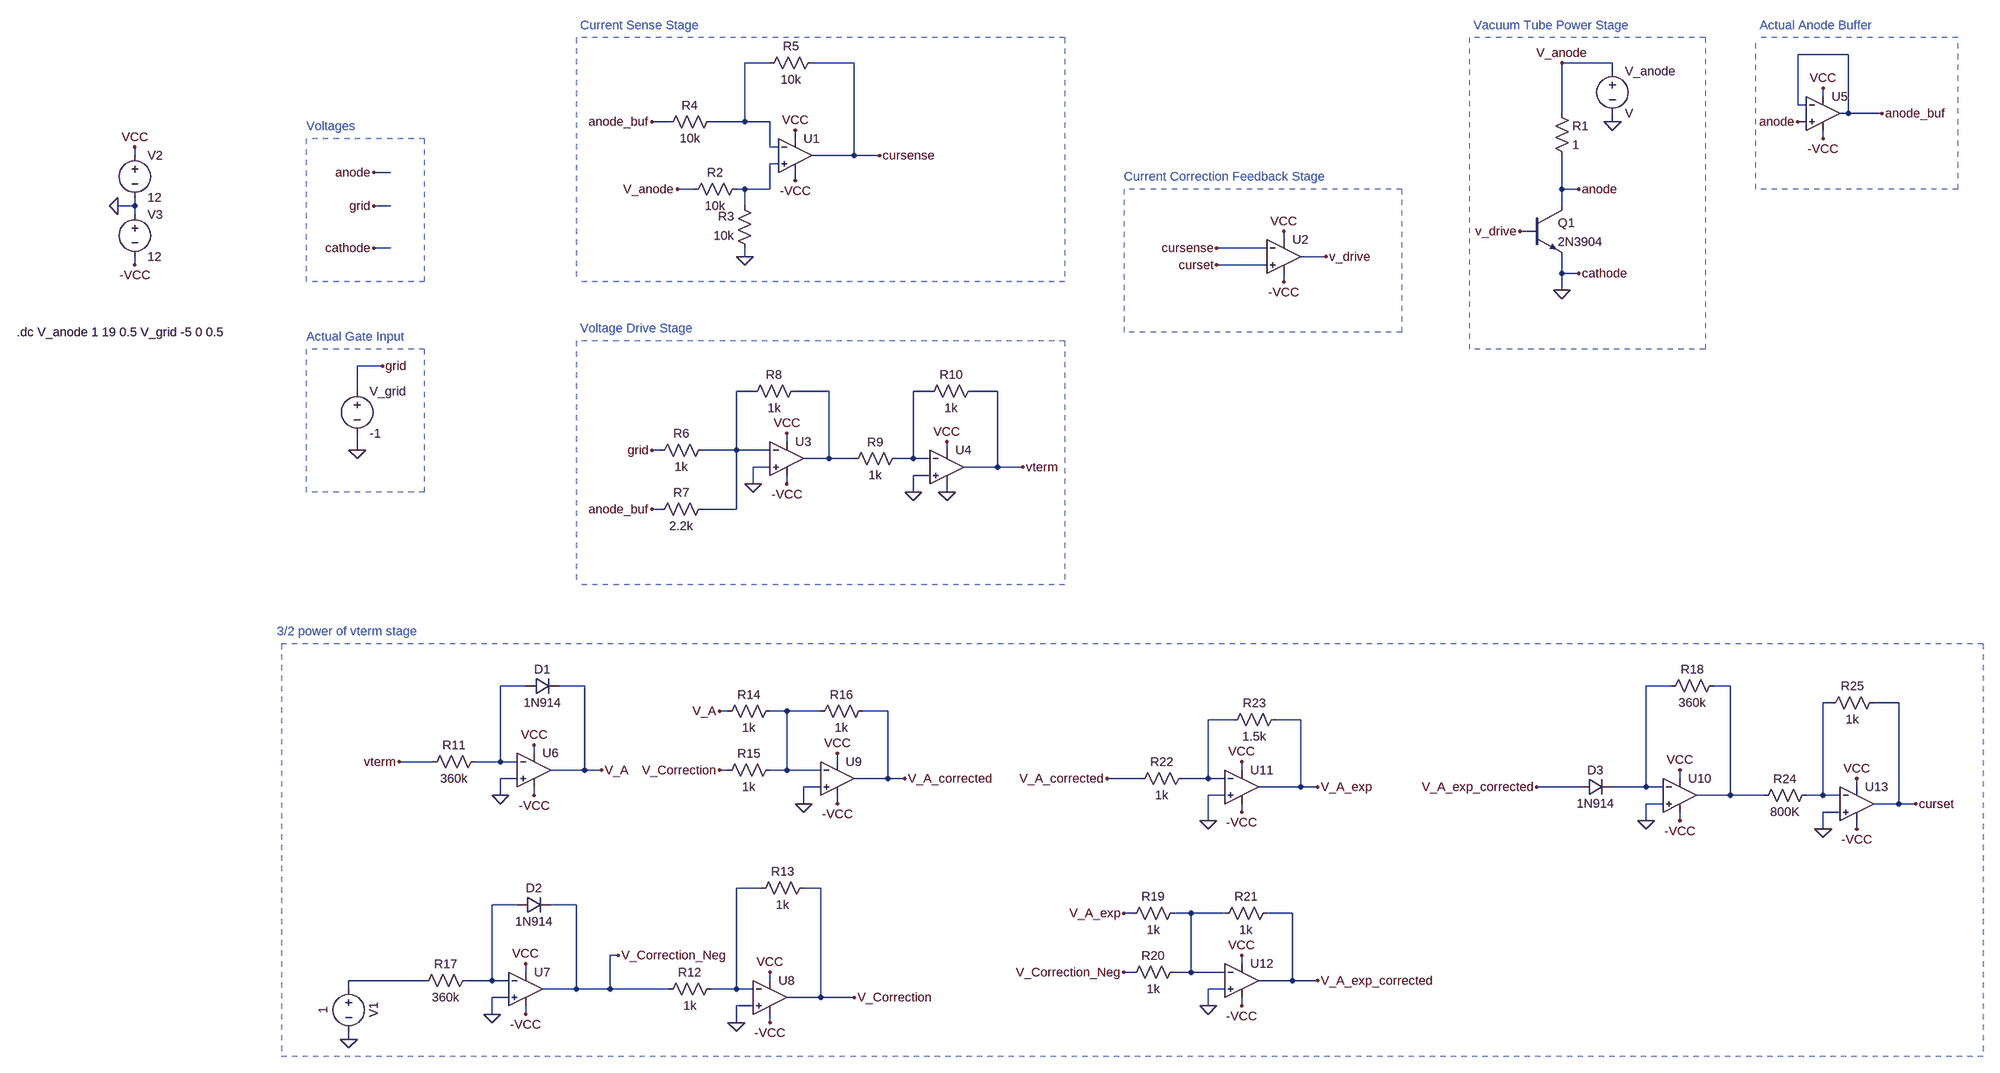
[diagram p0: schematic tube_second_iteration.asc]
tube_second_iteration.asc, the LTspice schematic file:
Version 4
SHEET 1 4020 1812
WIRE 3184 -400 3088 -400
WIRE 1136 -384 1088 -384
WIRE 1296 -384 1216 -384
WIRE 2736 -384 2640 -384
WIRE 2736 -368 2736 -384
WIRE 3136 -320 3136 -336
WIRE 3088 -304 3088 -400
WIRE 3104 -304 3088 -304
WIRE 2640 -288 2640 -384
WIRE 3184 -288 3184 -400
WIRE 3184 -288 3168 -288
WIRE 3248 -288 3184 -288
WIRE 944 -272 912 -272
WIRE 1088 -272 1088 -384
WIRE 1088 -272 1024 -272
WIRE 1136 -272 1088 -272
WIRE 2736 -272 2736 -288
WIRE 3104 -272 3088 -272
WIRE 1184 -240 1184 -256
WIRE 3136 -240 3136 -256
WIRE 1136 -224 1136 -272
WIRE 1152 -224 1136 -224
WIRE -352 -208 -352 -224
WIRE 1296 -208 1296 -384
WIRE 1296 -208 1216 -208
WIRE 1344 -208 1296 -208
WIRE 1152 -192 1136 -192
WIRE 416 -176 384 -176
WIRE 1184 -160 1184 -176
WIRE 992 -144 960 -144
WIRE 1088 -144 1072 -144
WIRE 1136 -144 1136 -192
WIRE 1136 -144 1088 -144
WIRE 2640 -144 2640 -208
WIRE 2672 -144 2640 -144
WIRE -352 -112 -352 -128
WIRE -352 -112 -384 -112
WIRE 416 -112 384 -112
WIRE 1088 -112 1088 -144
WIRE 2640 -112 2640 -144
WIRE -352 -96 -352 -112
WIRE 2576 -64 2560 -64
WIRE 2112 -48 2112 -64
WIRE 416 -32 384 -32
WIRE 2080 -32 1984 -32
WIRE 1088 -16 1088 -32
WIRE 2192 -16 2144 -16
WIRE -352 0 -352 -16
WIRE 2080 0 1984 0
WIRE 2640 16 2640 -16
WIRE 2672 16 2640 16
WIRE 2112 32 2112 16
WIRE 2640 48 2640 16
WIRE 400 192 352 192
WIRE 352 240 352 192
WIRE 1104 240 1072 240
WIRE 1248 240 1184 240
WIRE 1440 240 1408 240
WIRE 1568 240 1520 240
WIRE 1168 336 1168 320
WIRE 352 352 352 320
WIRE 928 352 912 352
WIRE 1072 352 1072 240
WIRE 1072 352 1008 352
WIRE 1136 352 1072 352
WIRE 1472 352 1472 336
WIRE 1248 368 1248 240
WIRE 1248 368 1200 368
WIRE 1296 368 1248 368
WIRE 1408 368 1408 240
WIRE 1408 368 1376 368
WIRE 1440 368 1408 368
WIRE 1136 384 1104 384
WIRE 1568 384 1568 240
WIRE 1568 384 1504 384
WIRE 1616 384 1568 384
WIRE 1440 400 1408 400
WIRE 1104 416 1104 384
WIRE 1168 416 1168 400
WIRE 1408 432 1408 400
WIRE 1472 432 1472 416
WIRE 928 464 912 464
WIRE 1072 464 1072 352
WIRE 1072 464 1008 464
WIRE 672 800 624 800
WIRE 784 800 736 800
WIRE 2848 800 2800 800
WIRE 2960 800 2928 800
WIRE 3152 832 3136 832
WIRE 3280 832 3232 832
WIRE 1056 848 1040 848
WIRE 1168 848 1136 848
WIRE 1232 848 1168 848
WIRE 1360 848 1312 848
WIRE 2016 864 1968 864
WIRE 2144 864 2096 864
WIRE 688 928 688 912
WIRE 496 944 432 944
WIRE 624 944 624 800
WIRE 624 944 576 944
WIRE 656 944 624 944
WIRE 1264 944 1264 928
WIRE 784 960 784 800
WIRE 784 960 720 960
WIRE 816 960 784 960
WIRE 1056 960 1040 960
WIRE 1168 960 1168 848
WIRE 1168 960 1136 960
WIRE 1232 960 1168 960
WIRE 2032 960 2032 944
WIRE 656 976 624 976
WIRE 1360 976 1360 848
WIRE 1360 976 1296 976
WIRE 1392 976 1360 976
WIRE 1840 976 1776 976
WIRE 1968 976 1968 864
WIRE 1968 976 1920 976
WIRE 2000 976 1968 976
WIRE 2864 976 2864 960
WIRE 1232 992 1200 992
WIRE 2144 992 2144 864
WIRE 2144 992 2064 992
WIRE 2176 992 2144 992
WIRE 2672 992 2592 992
WIRE 2800 992 2800 800
WIRE 2800 992 2736 992
WIRE 2832 992 2800 992
WIRE 3200 992 3200 976
WIRE 624 1008 624 976
WIRE 688 1008 688 992
WIRE 2000 1008 1968 1008
WIRE 2960 1008 2960 800
WIRE 2960 1008 2896 1008
WIRE 3024 1008 2960 1008
WIRE 3136 1008 3136 832
WIRE 3136 1008 3104 1008
WIRE 3168 1008 3136 1008
WIRE 1200 1024 1200 992
WIRE 1264 1024 1264 1008
WIRE 2832 1024 2800 1024
WIRE 3280 1024 3280 832
WIRE 3280 1024 3232 1024
WIRE 3312 1024 3280 1024
WIRE 2032 1040 2032 1024
WIRE 3168 1040 3136 1040
WIRE 1968 1056 1968 1008
WIRE 2800 1056 2800 1024
WIRE 2864 1056 2864 1040
WIRE 3136 1072 3136 1040
WIRE 3200 1072 3200 1056
WIRE 1120 1184 1072 1184
WIRE 1232 1184 1200 1184
WIRE 656 1216 608 1216
WIRE 768 1216 720 1216
WIRE 1824 1232 1808 1232
WIRE 1936 1232 1904 1232
WIRE 2000 1232 1936 1232
WIRE 2128 1232 2080 1232
WIRE 848 1312 832 1312
WIRE 2032 1328 2032 1312
WIRE 672 1344 672 1328
WIRE 1824 1344 1808 1344
WIRE 1936 1344 1936 1232
WIRE 1936 1344 1904 1344
WIRE 2000 1344 1936 1344
WIRE 480 1360 336 1360
WIRE 608 1360 608 1216
WIRE 608 1360 560 1360
WIRE 640 1360 608 1360
WIRE 1136 1360 1136 1344
WIRE 2128 1360 2128 1232
WIRE 2128 1360 2064 1360
WIRE 2176 1360 2128 1360
WIRE 336 1376 336 1360
WIRE 768 1376 768 1216
WIRE 768 1376 704 1376
WIRE 832 1376 832 1312
WIRE 832 1376 768 1376
WIRE 944 1376 832 1376
WIRE 1072 1376 1072 1184
WIRE 1072 1376 1024 1376
WIRE 1104 1376 1072 1376
WIRE 2000 1376 1968 1376
WIRE 640 1392 608 1392
WIRE 1232 1392 1232 1184
WIRE 1232 1392 1168 1392
WIRE 1296 1392 1232 1392
WIRE 1104 1408 1072 1408
WIRE 1968 1408 1968 1376
WIRE 2032 1408 2032 1392
WIRE 608 1424 608 1392
WIRE 672 1424 672 1408
WIRE 1072 1440 1072 1408
WIRE 1136 1440 1136 1424
WIRE 336 1472 336 1456
FLAG -384 -112 0
FLAG -352 -224 VCC
FLAG -352 0 -VCC
FLAG 2640 48 0
FLAG 3248 -288 anode_buf
FLAG 1088 -16 0
FLAG 1184 -256 VCC
FLAG 1184 -160 -VCC
FLAG 912 -272 anode_buf
FLAG 1344 -208 cursense
FLAG 1984 -32 cursense
FLAG 2112 -64 VCC
FLAG 2112 32 -VCC
FLAG 400 192 grid
FLAG 352 352 0
FLAG 1104 416 0
FLAG 1168 320 VCC
FLAG 912 464 anode_buf
FLAG 912 352 grid
FLAG 1408 432 0
FLAG 1472 336 VCC
FLAG 1616 384 vterm
FLAG 1168 416 -VCC
FLAG 1472 432 0
FLAG 3136 -336 VCC
FLAG 3136 -240 -VCC
FLAG 2736 -272 0
FLAG 2640 -384 V_anode
FLAG 960 -144 V_anode
FLAG 2672 -144 anode
FLAG 3088 -272 anode
FLAG 2672 16 cathode
FLAG 2192 -16 v_drive
FLAG 2560 -64 v_drive
FLAG 384 -112 grid
FLAG 384 -176 anode
FLAG 384 -32 cathode
FLAG 608 1424 0
FLAG 336 1472 0
FLAG 624 1008 0
FLAG 1072 1440 0
FLAG 1296 1392 V_Correction
FLAG 1040 848 V_A
FLAG 1040 960 V_Correction
FLAG 1200 1024 0
FLAG 1392 976 V_A_corrected
FLAG 2800 1056 0
FLAG 848 1312 V_Correction_Neg
FLAG 1776 976 V_A_corrected
FLAG 1968 1408 0
FLAG 1808 1232 V_A_exp
FLAG 2176 992 V_A_exp
FLAG 2176 1360 V_A_exp_corrected
FLAG 1808 1344 V_Correction_Neg
FLAG 2592 992 V_A_exp_corrected
FLAG 1968 1056 0
FLAG 816 960 V_A
FLAG 688 912 VCC
FLAG 688 1008 -VCC
FLAG 1264 928 VCC
FLAG 1264 1024 -VCC
FLAG 672 1328 VCC
FLAG 672 1424 -VCC
FLAG 1136 1344 VCC
FLAG 1136 1440 -VCC
FLAG 2032 944 VCC
FLAG 2032 1040 -VCC
FLAG 2032 1312 VCC
FLAG 2032 1408 -VCC
FLAG 2864 960 VCC
FLAG 2864 1056 -VCC
FLAG 432 944 vterm
FLAG 3200 976 VCC
FLAG 3200 1072 -VCC
FLAG 3136 1072 0
FLAG 3312 1024 curset
FLAG 1984 0 curset
SYMBOL npn 2576 -112 R0
SYMATTR InstName Q1
SYMATTR Value 2N3904
SYMBOL voltage -352 -224 R0
WINDOW 123 0 0 Left 0
WINDOW 39 0 0 Left 0
SYMATTR InstName V2
SYMATTR Value 12
SYMBOL voltage -352 -112 R0
WINDOW 123 0 0 Left 0
WINDOW 39 0 0 Left 0
SYMATTR InstName V3
SYMATTR Value 12
SYMBOL OpAmps\\UniversalOpAmp2 1184 -208 R0
SYMATTR InstName U1
SYMBOL res 1088 -160 R90
WINDOW 0 0 56 VBottom 2
WINDOW 3 32 56 VTop 2
SYMATTR InstName R2
SYMATTR Value 10k
SYMBOL res 1104 -16 R180
WINDOW 0 36 76 Left 2
WINDOW 3 36 40 Left 2
SYMATTR InstName R3
SYMATTR Value 10k
SYMBOL res 1040 -288 R90
WINDOW 0 0 56 VBottom 2
WINDOW 3 32 56 VTop 2
SYMATTR InstName R4
SYMATTR Value 10k
SYMBOL res 1232 -400 R90
WINDOW 0 0 56 VBottom 2
WINDOW 3 32 56 VTop 2
SYMATTR InstName R5
SYMATTR Value 10k
SYMBOL OpAmps\\UniversalOpAmp2 2112 -16 R0
SYMATTR InstName U2
SYMBOL voltage 352 224 R0
WINDOW 123 0 0 Left 0
WINDOW 39 0 0 Left 0
SYMATTR InstName V_grid
SYMATTR Value -1
SYMBOL OpAmps\\UniversalOpAmp2 1168 368 R0
SYMATTR InstName U3
SYMBOL res 1024 336 R90
WINDOW 0 0 56 VBottom 2
WINDOW 3 32 56 VTop 2
SYMATTR InstName R6
SYMATTR Value 1k
SYMBOL res 1024 448 R90
WINDOW 0 0 56 VBottom 2
WINDOW 3 32 56 VTop 2
SYMATTR InstName R7
SYMATTR Value 2.2k
SYMBOL res 1200 224 R90
WINDOW 0 0 56 VBottom 2
WINDOW 3 32 56 VTop 2
SYMATTR InstName R8
SYMATTR Value 1k
SYMBOL res 1392 352 R90
WINDOW 0 0 56 VBottom 2
WINDOW 3 32 56 VTop 2
SYMATTR InstName R9
SYMATTR Value 1k
SYMBOL OpAmps\\UniversalOpAmp2 1472 384 R0
SYMATTR InstName U4
SYMBOL res 1536 224 R90
WINDOW 0 0 56 VBottom 2
WINDOW 3 32 56 VTop 2
SYMATTR InstName R10
SYMATTR Value 1k
SYMBOL OpAmps\\UniversalOpAmp2 3136 -288 R0
SYMATTR InstName U5
SYMBOL voltage 2736 -384 R0
SYMATTR InstName V_anode
SYMBOL res 2624 -304 R0
SYMATTR InstName R1
SYMATTR Value 1
SYMBOL voltage 336 1360 R0
WINDOW 0 32 56 VTop 2
WINDOW 3 -32 56 VBottom 2
WINDOW 123 0 0 Left 0
WINDOW 39 0 0 Left 0
SYMATTR InstName V1
SYMATTR Value 1
SYMBOL res 592 928 R90
WINDOW 0 0 56 VBottom 2
WINDOW 3 32 56 VTop 2
SYMATTR InstName R11
SYMATTR Value 360k
SYMBOL res 1040 1360 R90
WINDOW 0 0 56 VBottom 2
WINDOW 3 32 56 VTop 2
SYMATTR InstName R12
SYMATTR Value 1k
SYMBOL res 1216 1168 R90
WINDOW 0 0 56 VBottom 2
WINDOW 3 32 56 VTop 2
SYMATTR InstName R13
SYMATTR Value 1k
SYMBOL res 1152 832 R90
WINDOW 0 0 56 VBottom 2
WINDOW 3 32 56 VTop 2
SYMATTR InstName R14
SYMATTR Value 1k
SYMBOL res 1152 944 R90
WINDOW 0 0 56 VBottom 2
WINDOW 3 32 56 VTop 2
SYMATTR InstName R15
SYMATTR Value 1k
SYMBOL res 1328 832 R90
WINDOW 0 0 56 VBottom 2
WINDOW 3 32 56 VTop 2
SYMATTR InstName R16
SYMATTR Value 1k
SYMBOL diode 672 816 R270
WINDOW 0 32 32 VTop 2
WINDOW 3 0 32 VBottom 2
SYMATTR InstName D1
SYMATTR Value 1N914
SYMBOL diode 656 1232 R270
WINDOW 0 32 32 VTop 2
WINDOW 3 0 32 VBottom 2
SYMATTR InstName D2
SYMATTR Value 1N914
SYMBOL diode 2672 1008 R270
WINDOW 0 32 32 VTop 2
WINDOW 3 0 32 VBottom 2
SYMATTR InstName D3
SYMATTR Value 1N914
SYMBOL res 576 1344 R90
WINDOW 0 0 56 VBottom 2
WINDOW 3 32 56 VTop 2
SYMATTR InstName R17
SYMATTR Value 360k
SYMBOL res 2944 784 R90
WINDOW 0 0 56 VBottom 2
WINDOW 3 32 56 VTop 2
SYMATTR InstName R18
SYMATTR Value 360k
SYMBOL res 1920 1216 R90
WINDOW 0 0 56 VBottom 2
WINDOW 3 32 56 VTop 2
SYMATTR InstName R19
SYMATTR Value 1k
SYMBOL res 1920 1328 R90
WINDOW 0 0 56 VBottom 2
WINDOW 3 32 56 VTop 2
SYMATTR InstName R20
SYMATTR Value 1k
SYMBOL res 2096 1216 R90
WINDOW 0 0 56 VBottom 2
WINDOW 3 32 56 VTop 2
SYMATTR InstName R21
SYMATTR Value 1k
SYMBOL res 1824 992 R270
WINDOW 0 32 56 VTop 2
WINDOW 3 0 56 VBottom 2
SYMATTR InstName R22
SYMATTR Value 1k
SYMBOL res 2112 848 R90
WINDOW 0 0 56 VBottom 2
WINDOW 3 32 56 VTop 2
SYMATTR InstName R23
SYMATTR Value 1.5k
SYMBOL OpAmps\\UniversalOpAmp2 688 960 R0
SYMATTR InstName U6
SYMBOL OpAmps\\UniversalOpAmp2 1264 976 R0
SYMATTR InstName U9
SYMBOL OpAmps\\UniversalOpAmp2 672 1376 R0
SYMATTR InstName U7
SYMBOL OpAmps\\UniversalOpAmp2 1136 1392 R0
SYMATTR InstName U8
SYMBOL OpAmps\\UniversalOpAmp2 2032 992 R0
SYMATTR InstName U11
SYMBOL OpAmps\\UniversalOpAmp2 2032 1360 R0
SYMATTR InstName U12
SYMBOL OpAmps\\UniversalOpAmp2 2864 1008 R0
SYMATTR InstName U10
SYMBOL OpAmps\\UniversalOpAmp2 3200 1024 R0
SYMATTR InstName U13
SYMBOL res 3120 992 R90
WINDOW 0 0 56 VBottom 2
WINDOW 3 32 56 VTop 2
SYMATTR InstName R24
SYMATTR Value 800K
SYMBOL res 3248 816 R90
WINDOW 0 0 56 VBottom 2
WINDOW 3 32 56 VTop 2
SYMATTR InstName R25
SYMATTR Value 1k
TEXT -576 128 Left 2 !.dc V_anode 1 19 0.5 V_grid -5 0 0.5
TEXT 2472 -456 Left 2 ;Vacuum Tube Power Stage
TEXT 3016 -456 Left 2 ;Actual Anode Buffer
TEXT 256 136 Left 2 ;Actual Gate Input
TEXT 776 -456 Left 2 ;Current Sense Stage
TEXT 776 120 Left 2 ;Voltage Drive Stage
TEXT 1808 -168 Left 2 ;Current Correction Feedback Stage
TEXT 256 -264 Left 2 ;Voltages
TEXT 200 696 Left 2 ;3/2 power of vterm stage
LINE Normal 2912 -432 2464 -432 2
LINE Normal 2464 -432 2464 160 2
LINE Normal 2912 160 2464 160 2
LINE Normal 2912 -432 2912 160 2
LINE Normal 3392 -432 3008 -432 2
LINE Normal 3392 -144 3008 -144 2
LINE Normal 3392 -144 3392 -432 2
LINE Normal 3008 -144 3008 -432 2
LINE Normal 480 160 256 160 2
LINE Normal 480 432 256 432 2
LINE Normal 480 432 480 160 2
LINE Normal 256 432 256 160 2
LINE Normal 768 -432 768 32 2
LINE Normal 1696 -432 1696 32 2
LINE Normal 1696 -432 768 -432 2
LINE Normal 1696 32 768 32 2
LINE Normal 1808 -144 1808 128 2
LINE Normal 2336 -144 2336 128 2
LINE Normal 2336 -144 1808 -144 2
LINE Normal 2336 128 1808 128 2
LINE Normal 768 144 768 608 2
LINE Normal 1696 144 1696 608 2
LINE Normal 1696 144 768 144 2
LINE Normal 1696 608 768 608 2
LINE Normal 480 -240 256 -240 2
LINE Normal 480 32 256 32 2
LINE Normal 480 32 480 -240 2
LINE Normal 256 32 256 -240 2
LINE Normal 3440 720 208 720 2
LINE Normal 3440 1504 208 1504 2
LINE Normal 3440 720 3440 1504 2
LINE Normal 208 720 208 1504 2

The netlist it stands for:
* tube_second_iteration.asc
Q1 anode v_drive 0 0 2N3904
V2 VCC 0 12
V3 0 -VCC 12
XU1 N002 N001 VCC -VCC cursense level2 Avol=1Meg GBW=10Meg Slew=10Meg Ilimit=25m Rail=0 Vos=0 En=0 Enk=0 In=0 Ink=0 Rin=500Meg  ; pins In+ In- V+ V- OUT
R2 N002 V_anode 10k
R3 0 N002 10k
R4 N001 anode_buf 10k
R5 cursense N001 10k
XU2 curset cursense VCC -VCC v_drive level2 Avol=1Meg GBW=10Meg Slew=10Meg Ilimit=25m Rail=0 Vos=0 En=0 Enk=0 In=0 Ink=0 Rin=500Meg  ; pins In+ In- V+ V- OUT
V_grid grid 0 -1
XU3 0 N003 VCC -VCC N004 level2 Avol=1Meg GBW=10Meg Slew=10Meg Ilimit=25m Rail=0 Vos=0 En=0 Enk=0 In=0 Ink=0 Rin=500Meg  ; pins In+ In- V+ V- OUT
R6 N003 grid 1k
R7 N003 anode_buf 2.2k
R8 N004 N003 1k
R9 N005 N004 1k
XU4 0 N005 VCC 0 vterm level2 Avol=1Meg GBW=10Meg Slew=10Meg Ilimit=25m Rail=0 Vos=0 En=0 Enk=0 In=0 Ink=0 Rin=500Meg  ; pins In+ In- V+ V- OUT
R10 vterm N005 1k
XU5 anode anode_buf VCC -VCC anode_buf level2 Avol=1Meg GBW=10Meg Slew=10Meg Ilimit=25m Rail=0 Vos=0 En=0 Enk=0 In=0 Ink=0 Rin=500Meg  ; pins In+ In- V+ V- OUT
V_anode V_anode 0 V
R1 V_anode anode 1
V1 N015 0 1
R11 N006 vterm 360k
R12 N012 V_Correction_Neg 1k
R13 V_Correction N012 1k
R14 N010 V_A 1k
R15 N010 V_Correction 1k
R16 V_A_corrected N010 1k
D1 N006 V_A 1N914
D2 N013 V_Correction_Neg 1N914
D3 V_A_exp_corrected N007 1N914
R17 N013 N015 360k
R18 N008 N007 360k
R19 N014 V_A_exp 1k
R20 N014 V_Correction_Neg 1k
R21 V_A_exp_corrected N014 1k
R22 V_A_corrected N011 1k
R23 V_A_exp N011 1.5k
XU6 0 N006 VCC -VCC V_A level2 Avol=1Meg GBW=10Meg Slew=10Meg Ilimit=25m Rail=0 Vos=0 En=0 Enk=0 In=0 Ink=0 Rin=500Meg  ; pins In+ In- V+ V- OUT
XU9 0 N010 VCC -VCC V_A_corrected level2 Avol=1Meg GBW=10Meg Slew=10Meg Ilimit=25m Rail=0 Vos=0 En=0 Enk=0 In=0 Ink=0 Rin=500Meg  ; pins In+ In- V+ V- OUT
XU7 0 N013 VCC -VCC V_Correction_Neg level2 Avol=1Meg GBW=10Meg Slew=10Meg Ilimit=25m Rail=0 Vos=0 En=0 Enk=0 In=0 Ink=0 Rin=500Meg  ; pins In+ In- V+ V- OUT
XU8 0 N012 VCC -VCC V_Correction level2 Avol=1Meg GBW=10Meg Slew=10Meg Ilimit=25m Rail=0 Vos=0 En=0 Enk=0 In=0 Ink=0 Rin=500Meg  ; pins In+ In- V+ V- OUT
XU11 0 N011 VCC -VCC V_A_exp level2 Avol=1Meg GBW=10Meg Slew=10Meg Ilimit=25m Rail=0 Vos=0 En=0 Enk=0 In=0 Ink=0 Rin=500Meg  ; pins In+ In- V+ V- OUT
XU12 0 N014 VCC -VCC V_A_exp_corrected level2 Avol=1Meg GBW=10Meg Slew=10Meg Ilimit=25m Rail=0 Vos=0 En=0 Enk=0 In=0 Ink=0 Rin=500Meg  ; pins In+ In- V+ V- OUT
XU10 0 N007 VCC -VCC N008 level2 Avol=1Meg GBW=10Meg Slew=10Meg Ilimit=25m Rail=0 Vos=0 En=0 Enk=0 In=0 Ink=0 Rin=500Meg  ; pins In+ In- V+ V- OUT
XU13 0 N009 VCC -VCC curset level2 Avol=1Meg GBW=10Meg Slew=10Meg Ilimit=25m Rail=0 Vos=0 En=0 Enk=0 In=0 Ink=0 Rin=500Meg  ; pins In+ In- V+ V- OUT
R24 N009 N008 800K
R25 curset N009 1k
.model D D
.lib standard.dio
.model NPN NPN
.model PNP PNP
.lib standard.bjt
.dc V_anode 1 19 0.5 V_grid -5 0 0.5
* Vacuum Tube Power Stage
* Actual Anode Buffer
* Actual Gate Input
* Current Sense Stage
* Voltage Drive Stage
* Current Correction Feedback Stage
* Voltages
* 3/2 power of vterm stage
.lib UniversalOpAmp2.lib
.backanno
.end